# Altium schematic sheet mainboard.SchDoc
size A; SheetNumber: 1; SheetTotal: 5
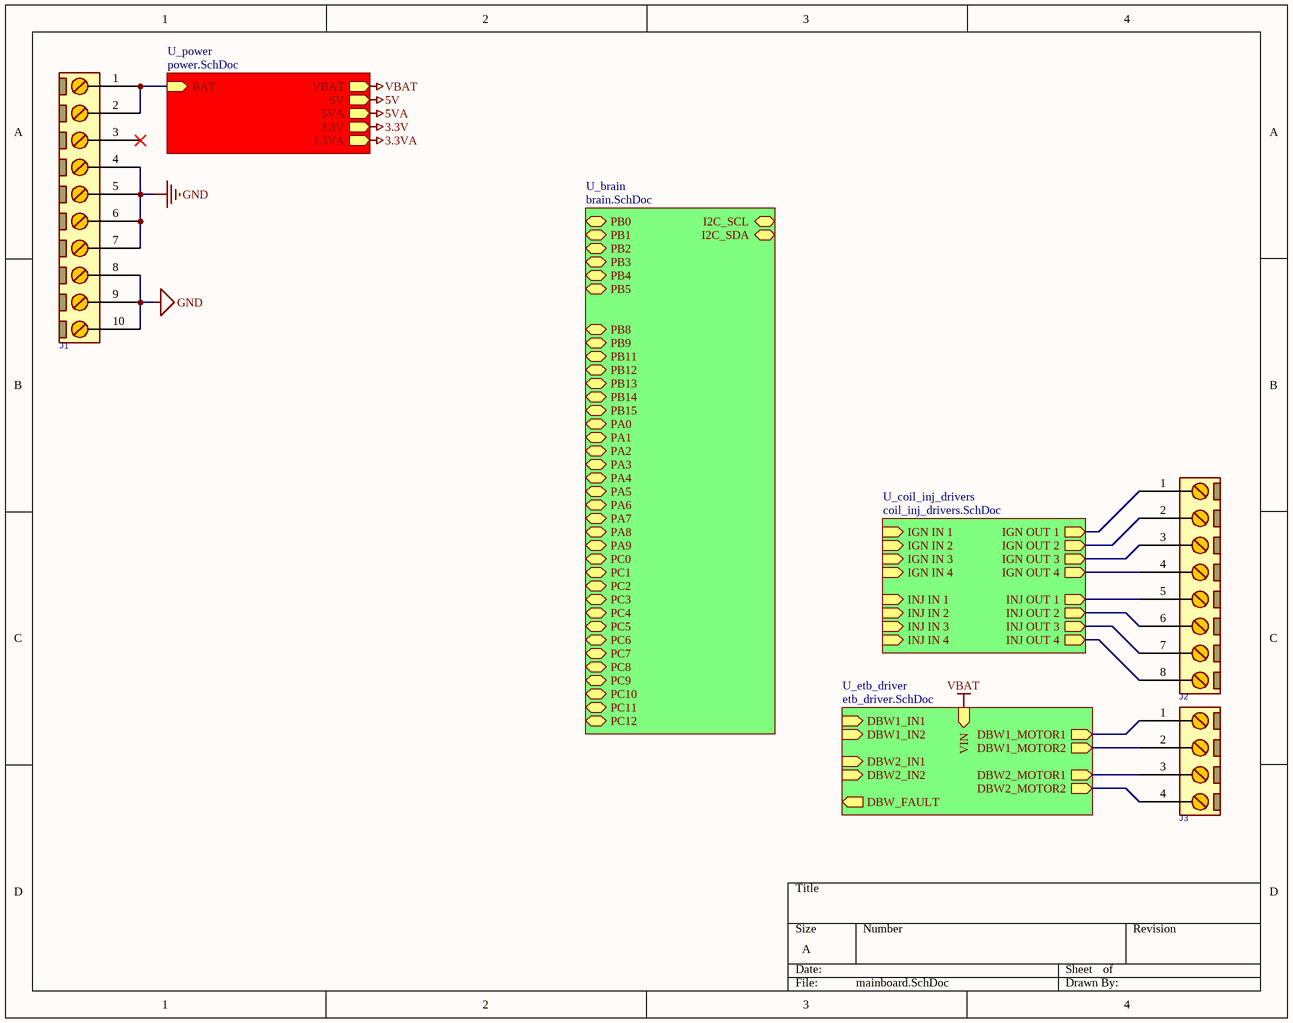
[diagram p0: mainboard.SchDoc]

## Parts
J1  CONN_TB10  [MSTB_10]  (value not drawn)
J2  CONN_TB8  [MSTB_8]  (value not drawn)
J3  CONN_TB4  [MSTB_4]  (value not drawn)

## Sub-sheets
U_brain = brain.SchDoc: PB0 (bidir), PB1 (bidir), PB2 (bidir), PB3 (bidir), PB4 (bidir), PB5 (bidir), I2C_SCL (bidir), I2C_SDA (bidir), PB8 (bidir), PB9 (bidir), PB11 (bidir), PB12 (bidir), PB13 (bidir), PB14 (bidir), PB15 (bidir), PA0 (bidir), PA1 (bidir), PA2 (bidir), PA3 (bidir), PA4 (bidir), PA5 (bidir), PA6 (bidir), PA7 (bidir), PA8 (bidir), PA9 (bidir), PC0 (bidir), PC1 (bidir), PC2 (bidir), PC3 (bidir), PC4 (bidir), PC5 (bidir), PC6 (bidir), PC7 (bidir), PC8 (bidir), PC9 (bidir), PC10 (bidir), PC11 (bidir), PC12 (bidir)
U_coil_inj_drivers = coil_inj_drivers.SchDoc: IGN IN 1 (in), IGN IN 2 (in), IGN IN 3 (in), IGN IN 4 (in), IGN OUT 1 (out), IGN OUT 2 (out), IGN OUT 3 (out), IGN OUT 4 (out), INJ OUT 4 (out), INJ OUT 3 (out), INJ OUT 2 (out), INJ OUT 1 (out), INJ IN 1 (in), INJ IN 2 (in), INJ IN 3 (in), INJ IN 4 (in)
U_etb_driver = etb_driver.SchDoc: VIN (in), DBW1_IN1 (in), DBW1_IN2 (in), DBW2_IN1 (in), DBW2_IN2 (in), DBW1_MOTOR1 (out), DBW1_MOTOR2 (out), DBW2_MOTOR1 (out), DBW2_MOTOR2 (out), DBW_FAULT (out)
U_power = power.SchDoc: BAT (in), VBAT (out), 5V (out), 5VA (out), 3.3V (out), 3.3VA (out)

## Nets
3.3V: sheet U_power/3.3V
3.3VA: sheet U_power/3.3VA
5V: sheet U_power/5V
5VA: sheet U_power/5VA
GND: J1.4 J1.5 J1.6 J1.7 J1.8 J1.9 J1.10
VBAT: sheet U_etb_driver/VIN, sheet U_power/VBAT
NetJ1_1: J1.1 J1.2 ; sheet U_power/BAT
NetJ2_1: J2.1 ; sheet U_coil_inj_drivers/IGN OUT 1
NetJ2_2: J2.2 ; sheet U_coil_inj_drivers/IGN OUT 2
NetJ2_3: J2.3 ; sheet U_coil_inj_drivers/IGN OUT 3
NetJ2_4: J2.4 ; sheet U_coil_inj_drivers/IGN OUT 4
NetJ2_5: J2.5 ; sheet U_coil_inj_drivers/INJ OUT 1
NetJ2_6: J2.6 ; sheet U_coil_inj_drivers/INJ OUT 2
NetJ2_7: J2.7 ; sheet U_coil_inj_drivers/INJ OUT 3
NetJ2_8: J2.8 ; sheet U_coil_inj_drivers/INJ OUT 4
NetJ3_1: J3.1 ; sheet U_etb_driver/DBW1_MOTOR1
NetJ3_2: J3.2 ; sheet U_etb_driver/DBW1_MOTOR2
NetJ3_3: J3.3 ; sheet U_etb_driver/DBW2_MOTOR1
NetJ3_4: J3.4 ; sheet U_etb_driver/DBW2_MOTOR2

Not connected (* = marked no-connect by the designer): J1 3*

## Library data of the parts
J1 = CONN_MSTB_10: CONN, PHOENIX MSTB, 5-G, 5.08mm pitch; PARAM2: 320V; PARAM: 12A; VALUE: CONN_TB10
J2 = CONN_MSTB_8: CONN, PHOENIX MSTB, 5-G, 5.08mm pitch; PARAM2: 320V; PARAM: 12A; VALUE: CONN_TB8
J3 = CONN_MSTB_4: CONN, PHOENIX MSTB, 5-G, 5.08mm pitch; PARAM2: 320V; PARAM: 12A; VALUE: CONN_TB4